# EAGLE design brick_serial_wisun (EAGLE 7.2.0)
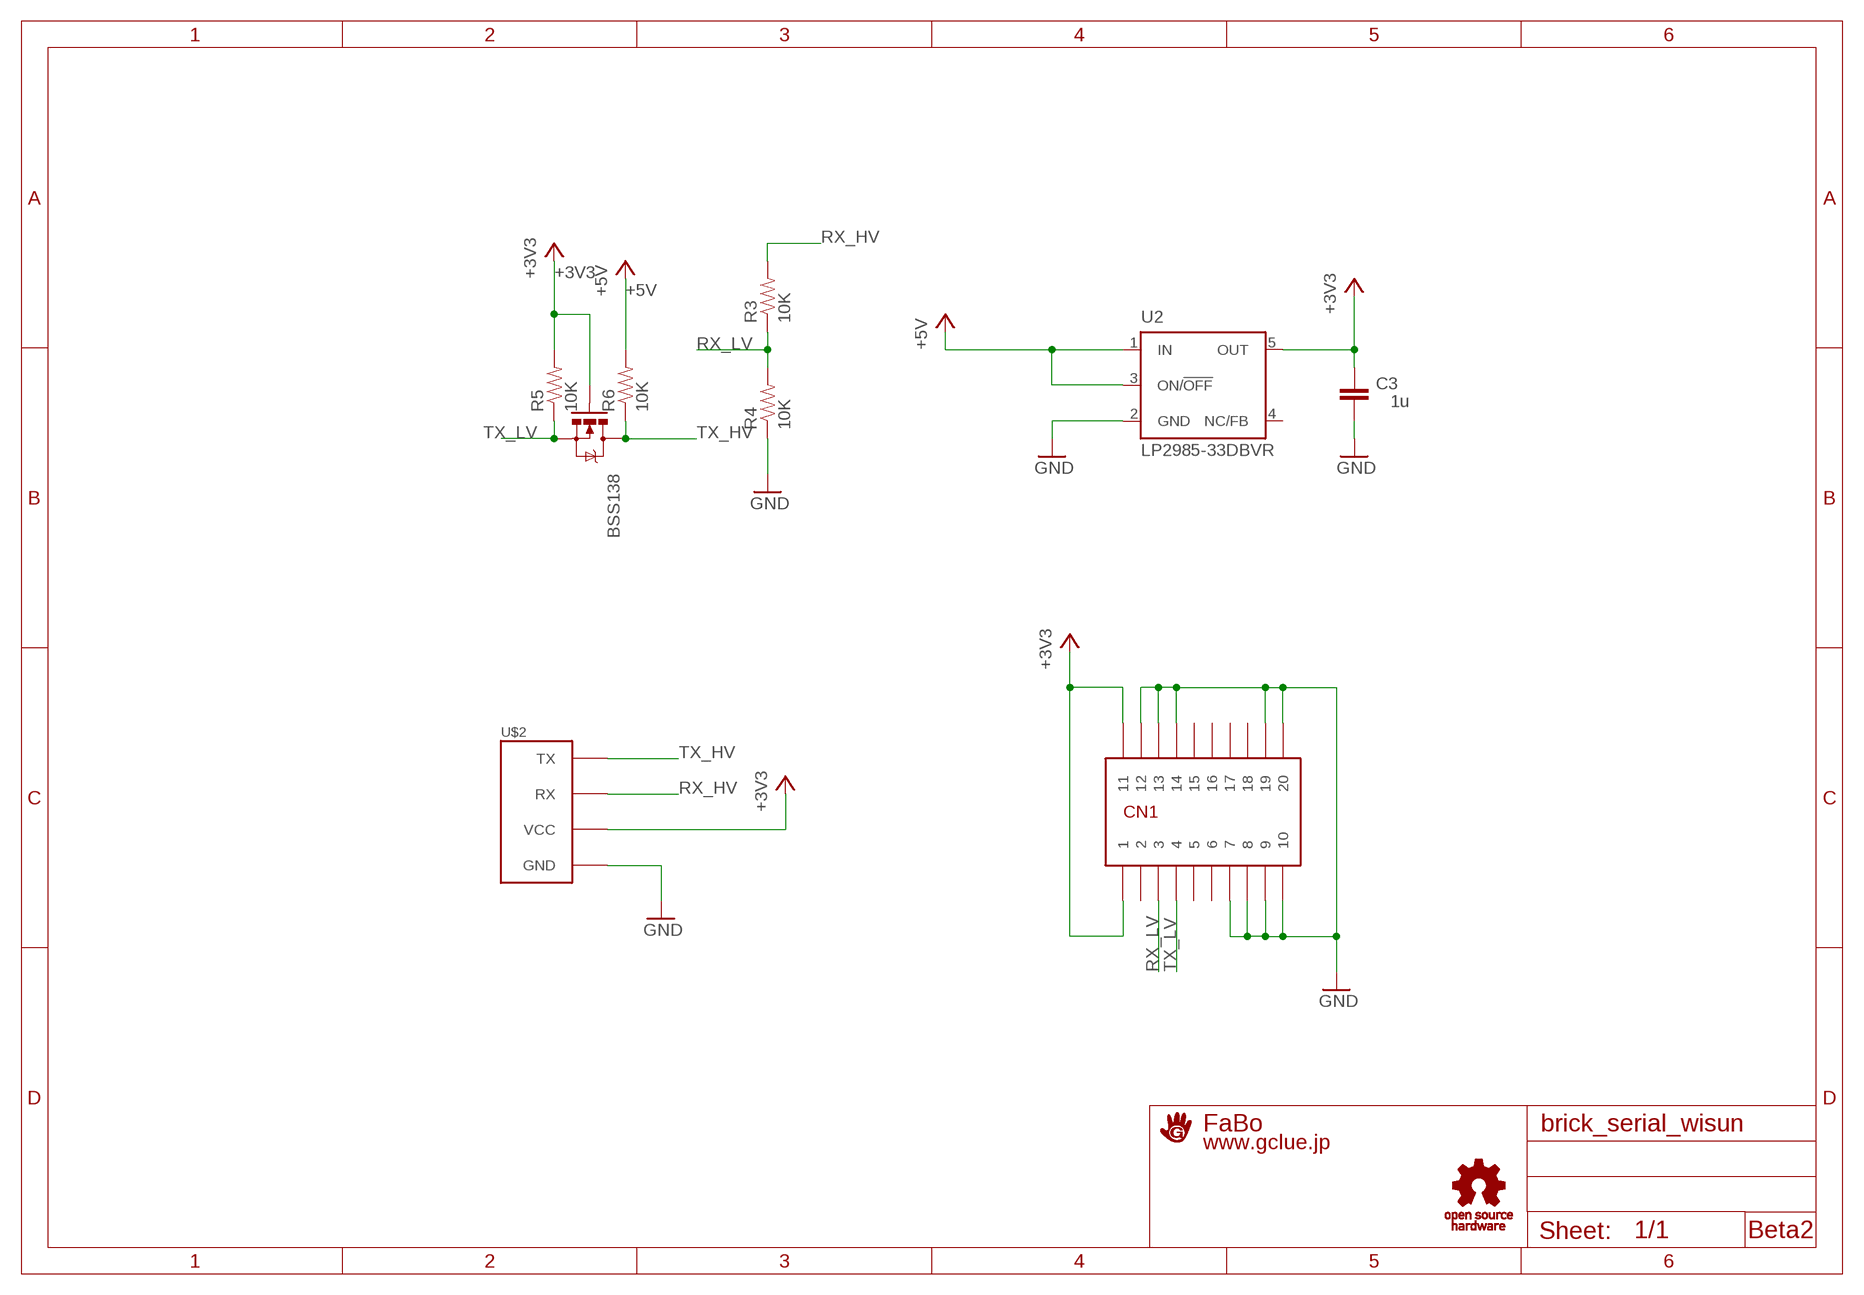
[diagram p0: schematic, sheet 1]

## Parts
BSS138  MOSFET-NCHANNELSMD  [SOT23-3]
C3  1u  C-EU0603-RND  [C0603-ROUND]
CN1  JST-20P3.0-JMCS  [JST-20P3.0-JMCS]
R3  10K  RESISTOR0603-RES  [0603-RES]
R4  10K  RESISTOR0603-RES  [0603-RES]
R5  10K  RESISTOR0603-RES  [0603-RES]
R6  10K  RESISTOR0603-RES  [0603-RES]
U2  LP2985-33DBVR  LP2985-XXDBVR33  [SOT23-DBV]
U$1  LOGO_OSHW_T-S  [LOGO_OSHW_T_S]
U$2  BRICK_SERIAL  [BRICK_SERIAL]
U$3  A4L-LOC-FABO_S  [LOGO_FABO_S]

## Nets
+3V3: BSS138.1(G) C3.2 CN1.10 CN1.20 R5.2 U2.5(OUT) U$2.VCC
+5V: R6.2 U2.1(IN) U2.3(ON/!OFF)
GND: C3.1 CN1.1 CN1.2 CN1.3 CN1.4 CN1.11 CN1.12 CN1.17 CN1.18 CN1.19 R4.1 U2.2(GND) U$2.GND
RX_HV: R3.2 U$2.RX
RX_LV: CN1.8 R3.1 R4.2
TX_HV: BSS138.3(D) R6.1 U$2.TX
TX_LV: BSS138.2(S) CN1.7 R5.1
Unconnected: CN1.5 CN1.6 CN1.9 CN1.13 CN1.14 CN1.15 CN1.16 U2.4(NC/FB)

## Notes on the sheet
- Beta2

## Library data of the parts
BSS138 = SparkFun:MOSFET-NCHANNEL
C3 = SmartPrj:C-EU: CAPACITOR, European symbol
CN1 = gclueParts:JST-20P3.0-JMCS
R3-R6 = SparkFun:RESISTOR: Resistor Basic schematic elements and footprints for 0603, 1206, and PTH resistors.
U2 = SmartPrj:LP2985-XXDBVR: ULTRALOW-POWER 50-mA LOW-DROPOUT LINEAR REGULATORS 50-mA Low-Dropout Regulator Source: http://focus.ti.com/lit/ds/symlink/tps77001.pdf
U$1 = gclue:LOGO_OSHW_T
U$2 = gclue:BRICK_SERIAL: FaBo Brick 4pin(SERIAL)
U$3 = gclue:A4L-LOC: FaBo A4 FRAME

## Board
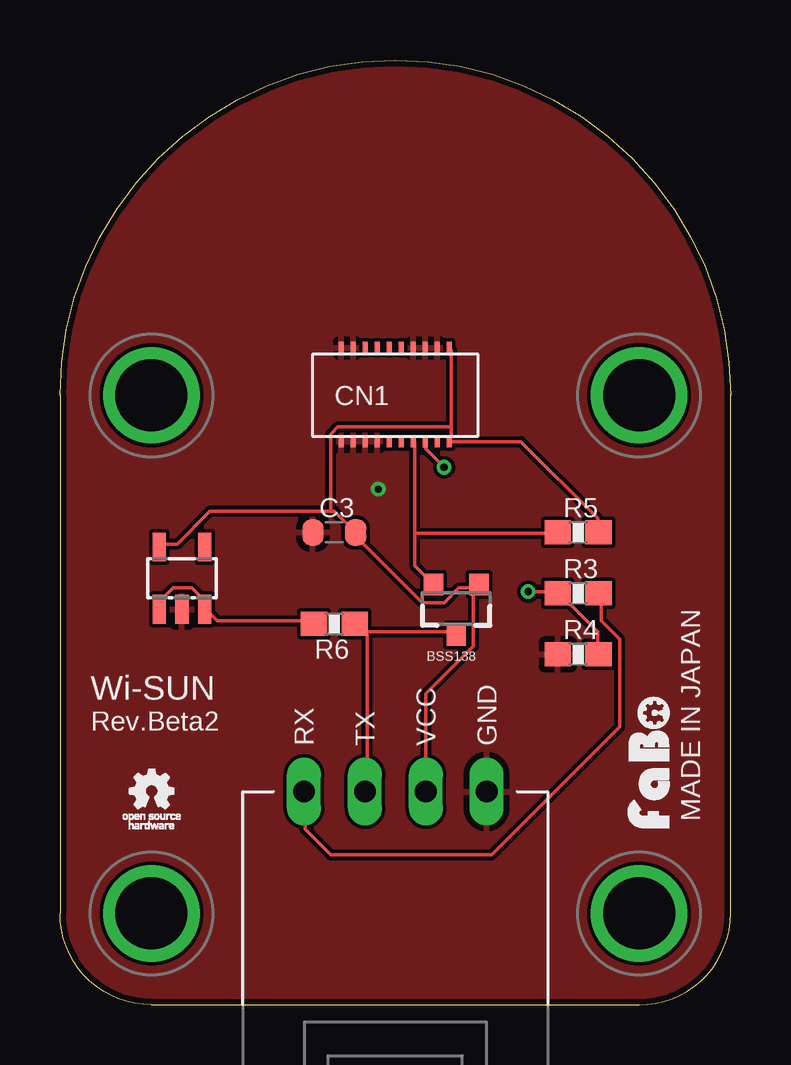
[diagram p1: board, top side]
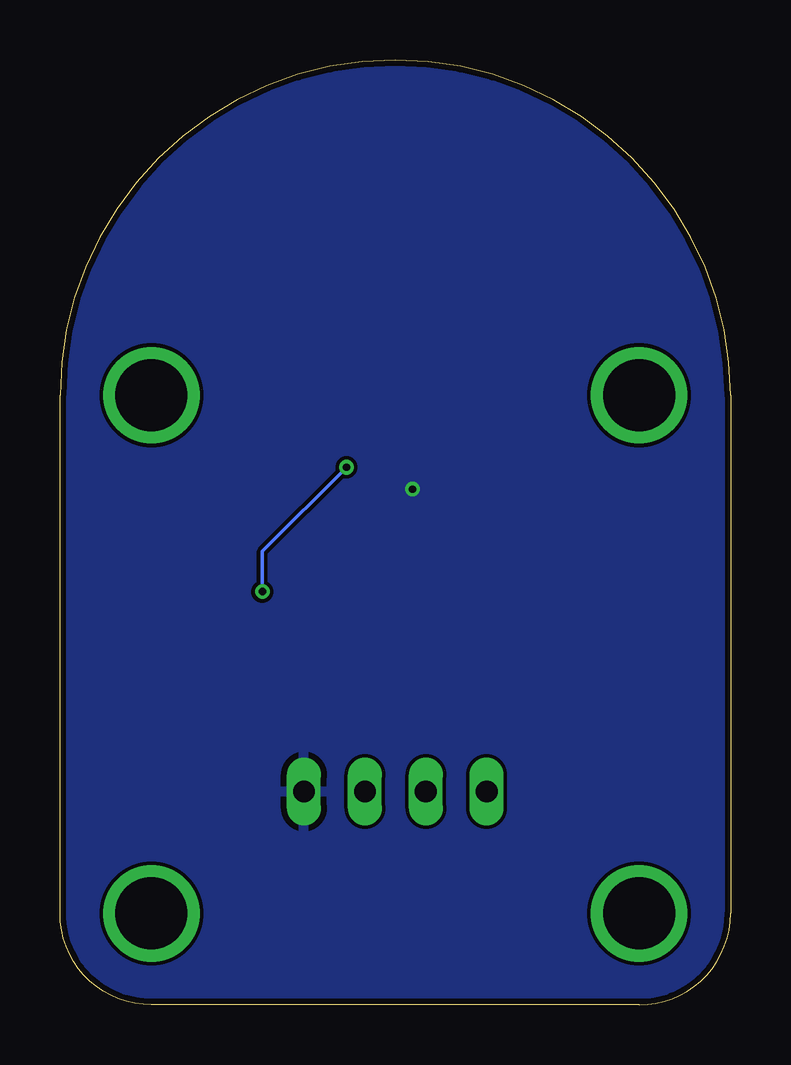
[diagram p2: board, bottom side, seen from below]

Size 27.94 x 39.37 mm. Coordinates in mm from the lower left corner, seen from the top.
Copper layers (1*16): Top 0.035mm / dielectric 1.5mm / Bottom 0.035mm
Design rules "Elecrow_2-layer_eagle_rule": minimum track width 6mil, minimum drill 12mil, track to track 6mil, track to pad 6mil, pad to pad 6mil, via to via 6mil, smd to smd 0mil, copper to edge 10mil, drill to drill 10mil, minimum pad ring 10mil, minimum via ring 6mil, stop-mask expansion 2mil, vias tented up to drill 100mil, thermal gap 10mil

### Footprints (pad centres in the part's own frame; a part is rotated, then mirrored left to right if it is on the bottom)
SOT23-3 = smd 0.8 x 0.9: 1 -0.95,-1; 2 0.95,-1; 3 0,1.1
C0603-ROUND = smd 0.898 x 1.1: 1 -0.889,0; 2 0.889,0
JST-20P3.0-JMCS = smd 0.2 x 0.5: 1 -2.252,-1.924; 2 -1.752,-1.924; 3 -1.252,-1.924; 4 -0.752,-1.924; 5 -0.252,-1.924; 6 0.248,-1.924; 7 0.748,-1.924; 8 1.248,-1.924; 9 1.748,-1.924; 10 2.248,-1.924; 11 -2.252,1.976; 12 -1.752,1.976; 13 -1.252,1.976; 14 -0.752,1.976; 15 -0.252,1.976; 16 0.248,1.976; 17 0.748,1.976; 18 1.248,1.976; 19 1.748,1.976; 20 2.248,1.976
0603-RES = smd 1.1 x 1: 1 -0.85,0; 2 0.85,0
SOT23-DBV = smd 0.55 x 1.2: 1 -0.95,-1.3; 2 0,-1.3; 3 0.95,-1.3; 4 0.95,1.3; 5 -0.95,1.3
BRICK_SERIAL = drill 0.9 long: GND 3.81,-10.16; RX -3.81,-10.16; TX -1.27,-10.16; VCC 1.27,-10.16 | drill 3 pad 3.81: P$5 -10.16,6.35; P$6 10.16,6.35; P$7 -10.16,-15.24; P$8 10.16,-15.24

### Placement (x,y rotation side)
BSS138  16.51,16.51 180 top
C3  11.43,19.68 0 top
CN1  13.97,25.4 0 top
R3  21.59,17.14 0 top
R4  21.59,14.61 0 top
R5  21.59,19.68 0 top
R6  11.43,15.88 180 top
U2  5.08,17.78 0 top
U$1  3.81,8.89 0 top
U$2  13.97,19.05 0 top
U$4  [LOGO_FABO_S]  25.4,10.16 90 top

### Tracks (layer width: path | path; a pad name or v marks a point on that pad's centre or on a via)
+3V3
  Top 0.152: 16.31,24.08 16.31,27.28 CN1.20 | 16.31,24.08 16.31,23.62 CN1.10 16.31,23.47 19.2,23.47 22.4,20.27 22.4,19.96 R5.2 | 17.22,17.37 16.61,17.37 16,16.76 15.09,16.76 12.19,19.66 C3.2 11.43,20.57 11.28,20.57 | 17.22,17.37 17.37,17.37 BSS138.1 17.22,17.37 | 11.28,20.57 6.25,20.57 4.88,19.2 4.27,19.2 U2.5 | U$2.VCC 15.24,12.95 17.22,14.94 17.22,17.37 | 16.31,24.08 11.58,24.08 11.28,23.77 11.28,20.57
+5V
  Top 0.152: R6.2 10.52,16 6.55,16 6.1,16.46 U2.3 5.94,16.61 5.94,16.92 5.49,17.37 4.72,17.37 4.27,16.92 4.27,16.61 U2.1
GND  (via drill 0.3)
  other vias: 13.26,21.49
  pour Bottom: -1.27,-1.27 29.21,-1.27 29.21,40.64 -1.27,40.64
  pour Top: -1.27,-1.27 29.21,-1.27 29.21,40.64 -1.27,40.64
RX_HV
  Top 0.152: U$2.RX 10.21,8.89 10.21,7.32 11.28,6.25 17.98,6.25 23.32,11.58 23.32,15.24 22.55,16 22.55,17.07 R3.2
RX_LV  (via drill 0.3)
  Top 0.152: v16,22.4 15.24,23.16 CN1.8 | v19.51,17.22 20.88,17.22 R3.1 20.88,17.07 22.4,15.54 22.4,14.63 R4.2
  Bottom 0.152: v16,22.4 19.51,18.9 v19.51,17.22
TX_HV
  Top 0.152: 12.8,15.54 12.65,15.54 12.34,15.85 R6.1 12.8,15.54 | 12.8,15.54 16.46,15.54 BSS138.3 | 12.8,15.54 12.8,8.99 U$2.TX
TX_LV
  Top 0.152: 14.78,19.66 14.78,18.29 15.54,17.53 BSS138.2 | 14.78,19.66 14.78,23.47 CN1.7 | 14.78,19.66 20.73,19.66 R5.1

### Text on the board
tPlace: Wi-SUN | MADE IN JAPAN | Rev.Beta2